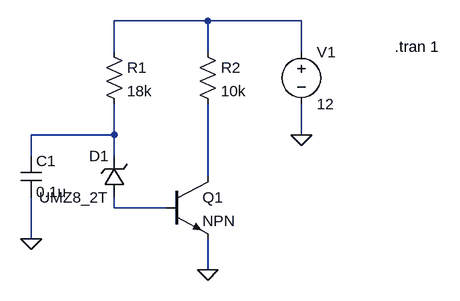
[diagram p0: schematic Draft9.asc]
Draft9.asc, the LTspice schematic file:
Version 4
SHEET 1 880 680
WIRE 416 32 272 32
WIRE 560 32 416 32
WIRE 272 80 272 32
WIRE 416 80 416 32
WIRE 560 80 560 32
WIRE 272 208 272 160
WIRE 272 208 144 208
WIRE 560 208 560 160
WIRE 144 240 144 208
WIRE 272 240 272 208
WIRE 416 272 416 160
WIRE 272 320 272 304
WIRE 352 320 272 320
WIRE 144 368 144 304
WIRE 416 416 416 368
FLAG 416 416 0
FLAG 144 368 0
FLAG 560 208 0
SYMBOL npn 352 272 R0
SYMATTR InstName Q1
SYMBOL zener 288 304 R180
WINDOW 0 24 64 Left 2
WINDOW 3 24 0 Left 2
SYMATTR InstName D1
SYMATTR Value UMZ8_2T
SYMBOL cap 128 240 R0
SYMATTR InstName C1
SYMATTR Value 0.1u
SYMBOL res 256 64 R0
SYMATTR InstName R1
SYMATTR Value 18k
SYMBOL res 400 64 R0
SYMATTR InstName R2
SYMATTR Value 10k
SYMBOL voltage 560 64 R0
SYMATTR InstName V1
SYMATTR Value 12
TEXT 704 72 Left 2 !.tran 1

The netlist it stands for:
* Draft9.asc
Q1 N003 N004 0 0 NPN
D1 N004 N002 UMZ8_2T
C1 N002 0 0.1u
R1 N001 N002 18k
R2 N001 N003 10k
V1 N001 0 12
.model D D
.lib standard.dio
.model NPN NPN
.model PNP PNP
.lib standard.bjt
.tran 1
.backanno
.end